# Altium schematic sheet UltraSonicTestHarnessBoard.SchDoc
size A4; Organization: Altium Limited; Address1: L3, 12a Rodborough Rd; Address2: Frenchs Forest; Address3: NSW; Address4: Australia 2086
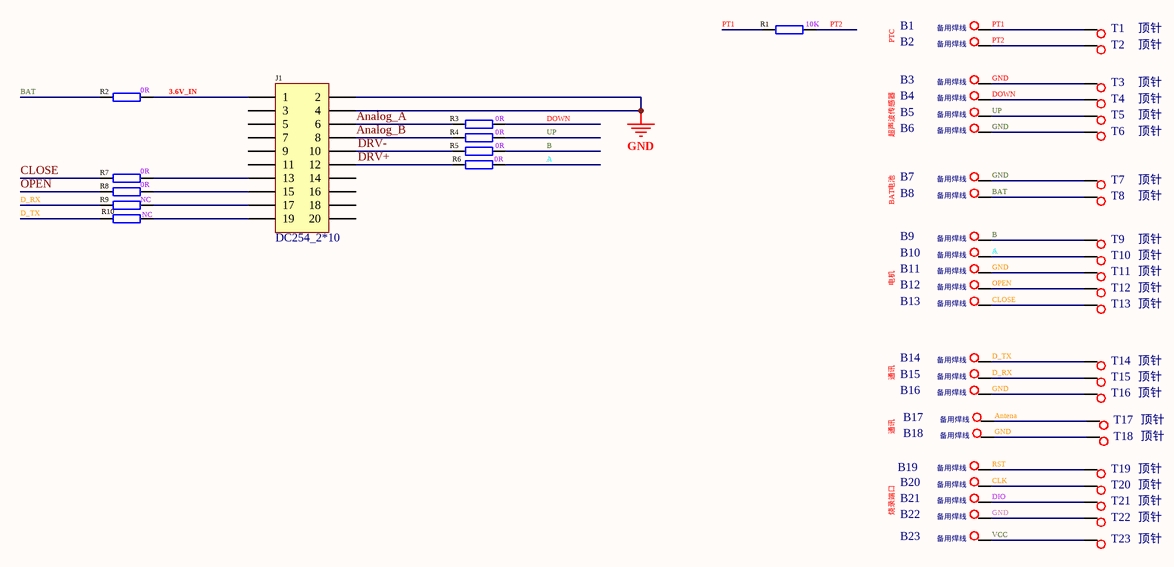
[diagram p0: UltraSonicTestHarnessBoard.SchDoc]

## Parts
B1  备用焊线  [TestPoint]
B2  备用焊线  [TestPoint]
B3  备用焊线  [TestPoint]
B4  备用焊线  [TestPoint]
B5  备用焊线  [TestPoint]
B6  备用焊线  [TestPoint]
B7  备用焊线  [TestPoint]
B8  备用焊线  [TestPoint]
B9  备用焊线  [TestPoint]
B10  备用焊线  [TestPoint]
B11  备用焊线  [TestPoint]
B12  备用焊线  [TestPoint]
B13  备用焊线  [TestPoint]
B14  备用焊线  [TestPoint]
B15  备用焊线  [TestPoint]
B16  备用焊线  [TestPoint]
B17  备用焊线  [TestPoint]
B18  备用焊线  [TestPoint]
B19  备用焊线  [TestPoint]
B20  备用焊线  [TestPoint]
B21  备用焊线  [TestPoint]
B22  备用焊线  [TestPoint]
B23  备用焊线  [TestPoint]
J1  DC254_2*10  [IDC2.54-LI-2x10P]
R1  10K  [R-1206]
R2  0R  [R-1206]
R3  0R  [R-1206]
R4  0R  [R-1206]
R5  0R  [R-1206]
R6  0R  [R-1206]
R7  0R  [R-1206]
R8  0R  [R-1206]
R9  NC  [R-1206]
R10  NC  [R-1206]
T1  顶针  [TestPoint]
T2  顶针  [TestPoint]
T3  顶针  [TestPoint]
T4  顶针  [TestPoint]
T5  顶针  [TestPoint]
T6  顶针  [TestPoint]
T7  顶针  [TestPoint]
T8  顶针  [TestPoint]
T9  顶针  [TestPoint]
T10  顶针  [TestPoint]
T11  顶针  [TestPoint]
T12  顶针  [TestPoint]
T13  顶针  [TestPoint]
T14  顶针  [TestPoint]
T15  顶针  [TestPoint]
T16  顶针  [TestPoint]
T17  顶针  [TestPoint]
T18  顶针  [TestPoint]
T19  顶针  [TestPoint]
T20  顶针  [TestPoint]
T21  顶针  [TestPoint]
T22  顶针  [TestPoint]
T23  顶针  [TestPoint]

## Nets
GND: B3.1 B6.1 B7.1 B11.1 B16.1 B18.1 B22.1 J1.2 J1.4 T3.1 T6.1 T7.1 T11.1 T16.1 T18.1 T22.1
3.6V_IN: J1.1 R2.2
A: B10.1 R6.1 T10.1
Analog_A: J1.6 R3.2
Analog_B: J1.8 R4.2
Antena: B17.1 T17.1
B: B9.1 R5.1 T9.1
BAT: B8.1 R2.1 T8.1
CLK: B20.1 T20.1
CLOSE: B13.1 R7.1 T13.1
D_RX: B15.1 R9.1 T15.1
D_TX: B14.1 R10.1 T14.1
DIO: B21.1 T21.1
DOWN: B4.1 R3.1 T4.1
DRV+: J1.12 R6.2
DRV-: J1.10 R5.2
OPEN: B12.1 R8.1 T12.1
PT1: B1.1 R1.2 T1.1
PT2: B2.1 R1.1 T2.1
RST: B19.1 T19.1
UP: B5.1 R4.1 T5.1
VCC: B23.1 T23.1
NetJ1_13: J1.13 R7.2
NetJ1_15: J1.15 R8.2
NetJ1_17: J1.17 R9.2
NetJ1_19: J1.19 R10.2

Not connected (* = marked no-connect by the designer): J1 3 5 7 9 11 14 16 18 20

## Notes on the sheet
- PTC
- 超声波传感器
- BAT电池
- 电机
- 通讯
- 烧录端口
- Title
- Size:
- Date:
- A4
- Number:
- Time:
- Revision:
- Sheet
- of
- File:

## Library data of the parts
B1-B23 T1-T23 = AD_WXHJ_TEST-POINT_01: 通孔测试点; Part Name: 测试点; ID: 24; SMD/DIP: SMD; Part Number: AD_WXHJ_TEST-POINT_01
J1 = 1010902-0139: DC2 2.54mm 2x10pin,2.54mm间距，2x10pin，32×8.55×27.5mm,母头,双排,双排牛角座; Part Name: DC牛角座; ID: 4; SMD/DIP: DIP; Part Number: 1010902-0139
R1-R10 = 101010101-0013: 0Ω,±5%,1/4W,1206,国巨,RC1206JR-070RL; Part Name: 1206贴片电阻; ID: 2; SMD/DIP: SMD; Part Number: 101010101-0013